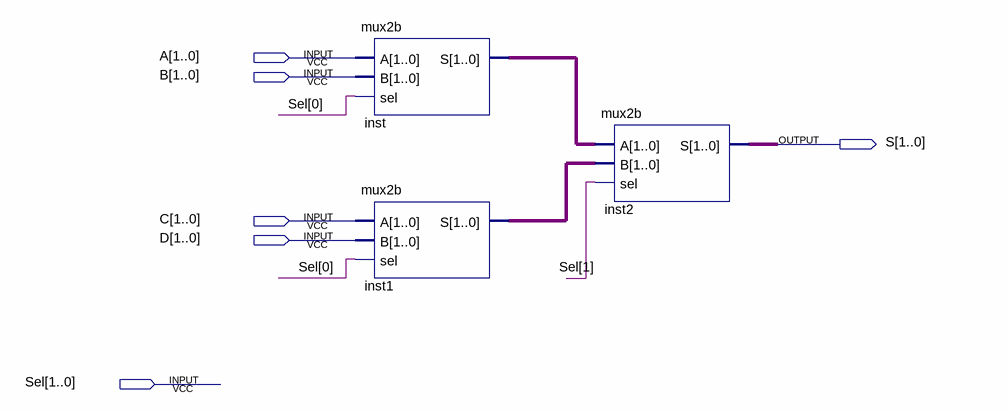
[diagram p0: schematic sheet]
// Quartus schematic mux2b2.bdf as structural Verilog: 3 symbols, 6 pins
module mux2b2 (
  input  [1:0] A,
  input  [1:0] B,
  input  [1:0] C,
  input  [1:0] D,
  input  [1:0] Sel,
  output [1:0] S
);

  wire [1:0] inst1_s, inst_s;

  mux2b inst (.A(A), .B(B), .sel(Sel[0]), .S(inst_s));
  mux2b inst1 (.A(C), .B(D), .sel(Sel[0]), .S(inst1_s));
  mux2b inst2 (.A(inst_s), .B(inst1_s), .sel(Sel[1]), .S(S));
endmodule
